# Altium schematic sheet Motor_Drivers.SchDoc
size A4; SheetNumber: 2; SheetTotal: 2
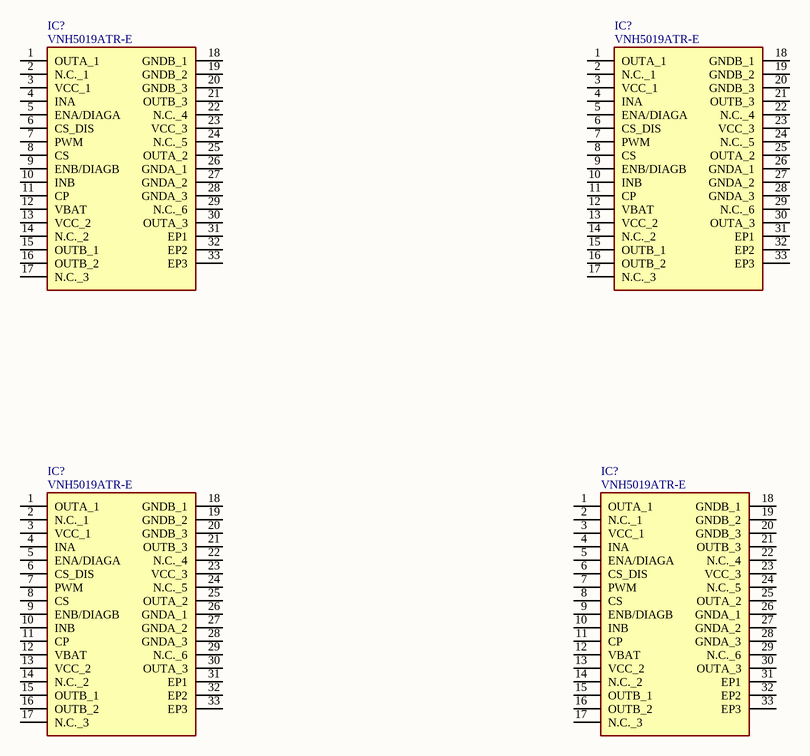
[diagram p0: Motor_Drivers.SchDoc]

## Parts
(Parts that share a designator on the sheet are numbered #1, #2 ... from top to bottom, then left to right.)
IC?#1  VNH5019ATR-E  [VNH5019A-E_1]
IC?#2  VNH5019ATR-E  [VNH5019A-E_1]
IC?#3  VNH5019ATR-E  [VNH5019A-E_1]
IC?#4  VNH5019ATR-E  [VNH5019A-E_1]

## Nets

Not connected (* = marked no-connect by the designer): IC?#1 1(OUTA_1) 2(N.C._1) 3(VCC_1) 4(INA) 5(ENA/DIAGA) 6(CS_DIS) 7(PWM) 8(CS) 9(ENB/DIAGB) 10(INB) 11(CP) 12(VBAT) 13(VCC_2) 14(N.C._2) 15(OUTB_1) 16(OUTB_2) 17(N.C._3) 18(GNDB_1) 19(GNDB_2) 20(GNDB_3) 21(OUTB_3) 22(N.C._4) 23(VCC_3) 24(N.C._5) 25(OUTA_2) 26(GNDA_1) 27(GNDA_2) 28(GNDA_3) 29(N.C._6) 30(OUTA_3) 31(EP1) 32(EP2) 33(EP3); IC?#2 1(OUTA_1) 2(N.C._1) 3(VCC_1) 4(INA) 5(ENA/DIAGA) 6(CS_DIS) 7(PWM) 8(CS) 9(ENB/DIAGB) 10(INB) 11(CP) 12(VBAT) 13(VCC_2) 14(N.C._2) 15(OUTB_1) 16(OUTB_2) 17(N.C._3) 18(GNDB_1) 19(GNDB_2) 20(GNDB_3) 21(OUTB_3) 22(N.C._4) 23(VCC_3) 24(N.C._5) 25(OUTA_2) 26(GNDA_1) 27(GNDA_2) 28(GNDA_3) 29(N.C._6) 30(OUTA_3) 31(EP1) 32(EP2) 33(EP3); IC?#3 1(OUTA_1) 2(N.C._1) 3(VCC_1) 4(INA) 5(ENA/DIAGA) 6(CS_DIS) 7(PWM) 8(CS) 9(ENB/DIAGB) 10(INB) 11(CP) 12(VBAT) 13(VCC_2) 14(N.C._2) 15(OUTB_1) 16(OUTB_2) 17(N.C._3) 18(GNDB_1) 19(GNDB_2) 20(GNDB_3) 21(OUTB_3) 22(N.C._4) 23(VCC_3) 24(N.C._5) 25(OUTA_2) 26(GNDA_1) 27(GNDA_2) 28(GNDA_3) 29(N.C._6) 30(OUTA_3) 31(EP1) 32(EP2) 33(EP3); IC?#4 1(OUTA_1) 2(N.C._1) 3(VCC_1) 4(INA) 5(ENA/DIAGA) 6(CS_DIS) 7(PWM) 8(CS) 9(ENB/DIAGB) 10(INB) 11(CP) 12(VBAT) 13(VCC_2) 14(N.C._2) 15(OUTB_1) 16(OUTB_2) 17(N.C._3) 18(GNDB_1) 19(GNDB_2) 20(GNDB_3) 21(OUTB_3) 22(N.C._4) 23(VCC_3) 24(N.C._5) 25(OUTA_2) 26(GNDA_1) 27(GNDA_2) 28(GNDA_3) 29(N.C._6) 30(OUTA_3) 31(EP1) 32(EP2) 33(EP3)

## Library data of the parts
IC?#1-IC?#4 = VNH5019ATR-E: Integrated Circuit; Manufacturer_Name: STMicroelectronics; Datasheet Link: https://www.st.com/resource/en/datasheet/vnh5019a-e.pdf; Manufacturer_Part_Number: VNH5019ATR-E; Mouser Part Number: 511-VNH5019ATR-E; Mouser Price/Stock: https://www.mouser.co.uk/ProductDetail/STMicroelectronics/VNH5019ATR-E?qs=T%2FOtf55vL7cDceYVZzSNKw%3D%3D; Arrow Part Number: VNH5019ATR-E; Arrow Price/Stock: https://www.arrow.com/en/products/vnh5019atr-e/stmicroelectronics?region=nac